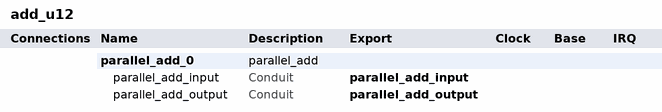
[diagram p0: system contents]
# Platform Designer (Qsys) system add_u12, Arria 10 10AX115N4F40I3SG
# Parameters at their usual value, and those the tool derives, are not listed.
package require qsys
create_system add_u12
set_project_property DEVICE_FAMILY {Arria 10}
set_project_property DEVICE 10AX115N4F40I3SG

add_instance parallel_add_0 parallel_add 18.1
set_instance_property parallel_add_0 AUTO_EXPORT true
set_instance_parameter_value parallel_add_0 GUI_ACLR false
set_instance_parameter_value parallel_add_0 GUI_CALCULATE {Automatically calculate the width}
set_instance_parameter_value parallel_add_0 GUI_CLKEN false
set_instance_parameter_value parallel_add_0 GUI_MSW_SUBTRACT Add
set_instance_parameter_value parallel_add_0 GUI_PIPELINE 2
set_instance_parameter_value parallel_add_0 GUI_REPRESENTATION UNSIGNED
set_instance_parameter_value parallel_add_0 GUI_SHIFT 0
set_instance_parameter_value parallel_add_0 GUI_SIZE 2
set_instance_parameter_value parallel_add_0 GUI_USE_LATENCY {Yes I want output latency of}
set_instance_parameter_value parallel_add_0 GUI_WIDTH 12
set_instance_parameter_value parallel_add_0 GUI_WIDTHR_VALUE 12

# exported interfaces
add_interface parallel_add_input conduit end
set_interface_property parallel_add_input EXPORT_OF parallel_add_0.parallel_add_input
add_interface parallel_add_output conduit end
set_interface_property parallel_add_output EXPORT_OF parallel_add_0.parallel_add_output

set_interconnect_requirement {$system} qsys_mm.clockCrossingAdapter HANDSHAKE
set_interconnect_requirement {$system} qsys_mm.enableEccProtection FALSE
set_interconnect_requirement {$system} qsys_mm.insertDefaultSlave FALSE
set_interconnect_requirement {$system} qsys_mm.maxAdditionalLatency 1

save_system add_u12.qsys
